# Altium project Soldering Station.PrjPcb
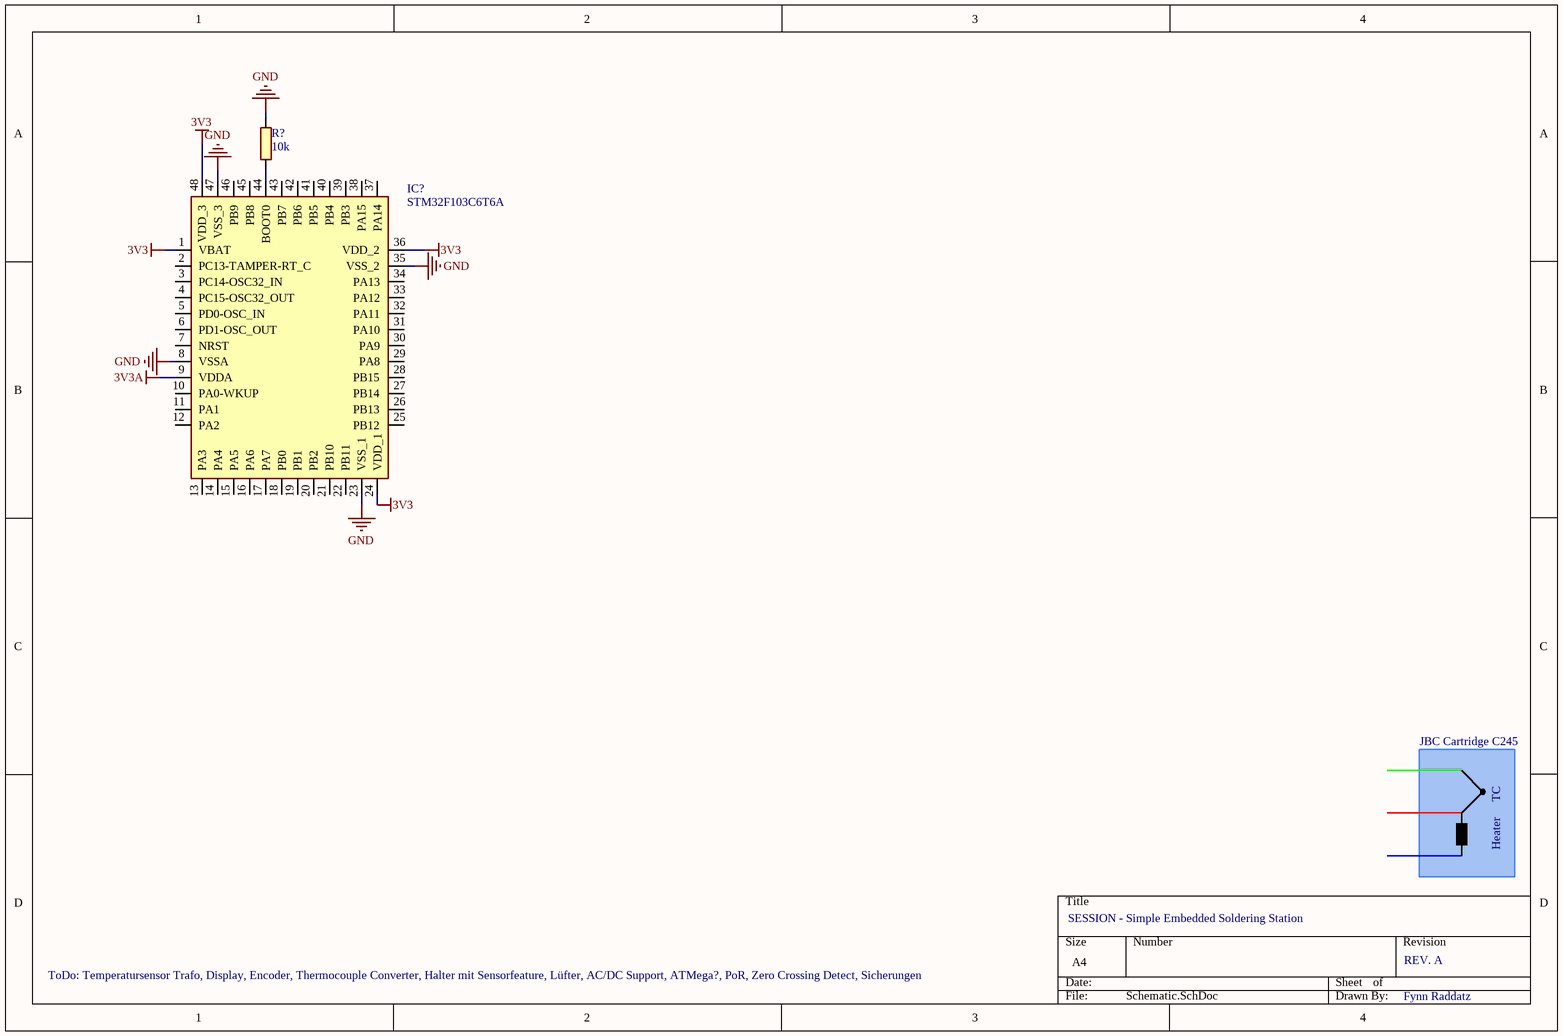
[diagram p0: Schematic.SchDoc]
1 sheet, 2 parts. Net scope: global (net labels, ports and power ports of the same name join across sheets).
Board file: PCB1.PcbDoc

## Sheet Schematic.SchDoc
size A4; SheetNumber: 1; SheetTotal: 1

### Parts
IC?  STM32F103C6T6A  [QFP50P900X900X160-48N]
R?  10k  [RESC2012X65N]

### Nets
3V3: IC?.1(VBAT) IC?.24(VDD_1) IC?.36(VDD_2) IC?.48(VDD_3)
3V3A: IC?.9(VDDA)
GND: IC?.8(VSSA) IC?.23(VSS_1) IC?.35(VSS_2) IC?.47(VSS_3) R?.2
NetIC?_44: IC?.44(BOOT0) R?.1

Not connected (* = marked no-connect by the designer): IC? 2(PC13-TAMPER-RT_C) 3(PC14-OSC32_IN) 4(PC15-OSC32_OUT) 5(PD0-OSC_IN) 6(PD1-OSC_OUT) 7(NRST) 10(PA0-WKUP) 11(PA1) 12(PA2) 13(PA3) 14(PA4) 15(PA5) 16(PA6) 17(PA7) 18(PB0) 19(PB1) 20(PB2) 21(PB10) 22(PB11) 25(PB12) 26(PB13) 27(PB14) 28(PB15) 29(PA8) 30(PA9) 31(PA10) 32(PA11) 33(PA12) 34(PA13) 37(PA14) 38(PA15) 39(PB3) 40(PB4) 41(PB5) 42(PB6) 43(PB7) 45(PB8) 46(PB9)

### Notes on the sheet
- JBC Cartridge C245
- Heater
- TC
- SESSION - Simple Embedded Soldering Station
- ToDo: Temperatursensor Trafo, Display, Encoder, Thermocouple Converter, Halter mit Sensorfeature, Lüfter, AC/DC Support, ATMega?, PoR, Zero Crossing Detect, Sicherungen
- REV. A
- Fynn Raddatz

### Library data of the parts
IC? = STM32F103C6T6A: Integrated Circuit; Manufacturer_Name: STMicroelectronics; Datasheet Link: http://www.st.com/st-web-ui/static/active/en/resource/technical/document/datasheet/CD00210843.pdf; Height: 1.6mm; Manufacturer_Part_Number: STM32F103C6T6A; Mouser Part Number: 511-STM32F103C6T6A; Mouser Price/Stock: https://www.mouser.co.uk/ProductDetail/STMicroelectronics/STM32F103C6T6A?qs=%252BB84zevwoRBiGXbwVLvaMw%3D%3D; Arrow Part Number: STM32F103C6T6A; Arrow Price/Stock: https://www.arrow.com/en/products/stm32f103c6t6a/stmicroelectronics
R? = Res 0805: Resistor; Manufacturer_Name: Stackpole Electronics Inc.; Manufacturer_Part_Number: RMCF0805ZT0R00; Datasheet Link: https://www.seielect.com/Catalog/SEI-RMCF_RMCP.pdf; Height: 0.65mm; Arrow Part Number: RMCF0805ZT0R00; Arrow Price/Stock: https://www.arrow.com/en/products/rmcf0805zt0r00/stackpole-electronics